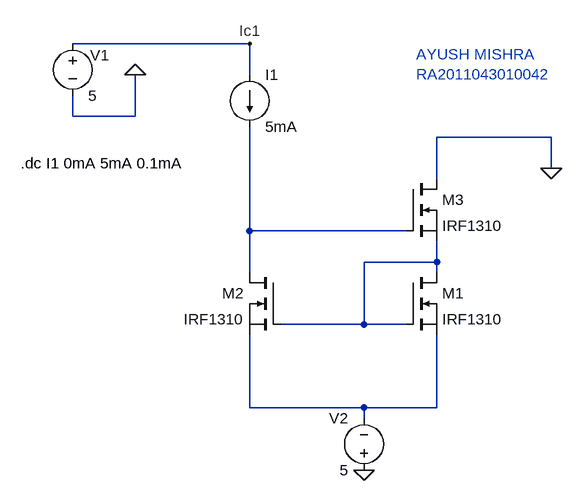
[diagram p0: schematic exp_12_wil.asc]
exp_12_wil.asc, the LTspice schematic file:
Version 4
SHEET 1 880 704
WIRE 112 0 -160 0
WIRE 112 48 112 0
WIRE -160 112 -160 80
WIRE -64 112 -64 48
WIRE -64 112 -160 112
WIRE 576 144 400 144
WIRE 576 192 576 144
WIRE 400 208 400 144
WIRE 112 288 112 128
WIRE 352 288 112 288
WIRE 400 336 400 304
WIRE 400 336 288 336
WIRE 112 352 112 288
WIRE 400 352 400 336
WIRE 288 432 288 336
WIRE 288 432 160 432
WIRE 352 432 288 432
WIRE 112 560 112 448
WIRE 288 560 112 560
WIRE 400 560 400 448
WIRE 400 560 288 560
WIRE 288 576 288 560
FLAG -64 48 0
FLAG 576 192 0
FLAG 288 656 0
FLAG 112 0 Ic1
SYMBOL current 112 48 R0
WINDOW 123 0 0 Left 0
WINDOW 39 0 0 Left 0
SYMATTR InstName I1
SYMATTR Value 5mA
SYMBOL voltage 288 672 R180
WINDOW 0 24 96 Left 2
WINDOW 3 24 16 Left 2
WINDOW 123 0 0 Left 0
WINDOW 39 0 0 Left 0
SYMATTR InstName V2
SYMATTR Value 5
SYMBOL nmos 352 352 R0
SYMATTR InstName M1
SYMATTR Value IRF1310
SYMBOL nmos 160 352 M0
SYMATTR InstName M2
SYMATTR Value IRF1310
SYMBOL nmos 352 208 R0
SYMATTR InstName M3
SYMATTR Value IRF1310
SYMBOL voltage -160 -16 R0
WINDOW 0 27 34 Left 2
WINDOW 123 0 0 Left 0
WINDOW 39 0 0 Left 0
SYMATTR InstName V1
SYMATTR Value 5
TEXT -240 184 Left 2 !.dc I1 0mA 5mA 0.1mA
TEXT 368 16 Left 2 ;AYUSH MISHRA\nRA2011043010042

The netlist it stands for:
* exp_12_wil.asc
I1 Ic1 N001 5mA
V2 0 N003 5
M1 N002 N002 N003 N003 IRF1310
M2 N001 N002 N003 N003 IRF1310
M3 0 N001 N002 N002 IRF1310
V1 Ic1 0 5
.model NMOS NMOS
.model PMOS PMOS
.lib standard.mos
.dc I1 0mA 5mA 0.1mA
* AYUSH MISHRA
* RA2011043010042
.backanno
.end